# Altium schematic sheet 30_PSFB_Converter.SchDoc
size A2; SheetNumber: 03; SheetTotal: 04; PageSetup: Record=PageOptions|SelectedOnly=False|CenterHorizontal=True|CenterVertical=True|PrintScale=1.00|XCorrection=1.00|YCorrection=1.00|PrintKind=0|BorderSize=5000000|LeftOffset=0|BottomOffset=0|Orientation=2|PaperLength=1000|PaperWidth=1000|Scale=100|PaperSource=7|PrintQuality=-4|MediaType=1|DitherType=10|PaperKind=Letter 8 ½ x 11 Zoll|PrintScaleMode=1; document: xxx; type: ESL; version: 03; standard_checked: PPS-W; mod_ind: 0; mod_quan: 0; change_number: xxxxxx; material_number: Labops_PCB04; replace_for_date: YYYY-MM-DD; replace_for_index: -; doc_type: ESP
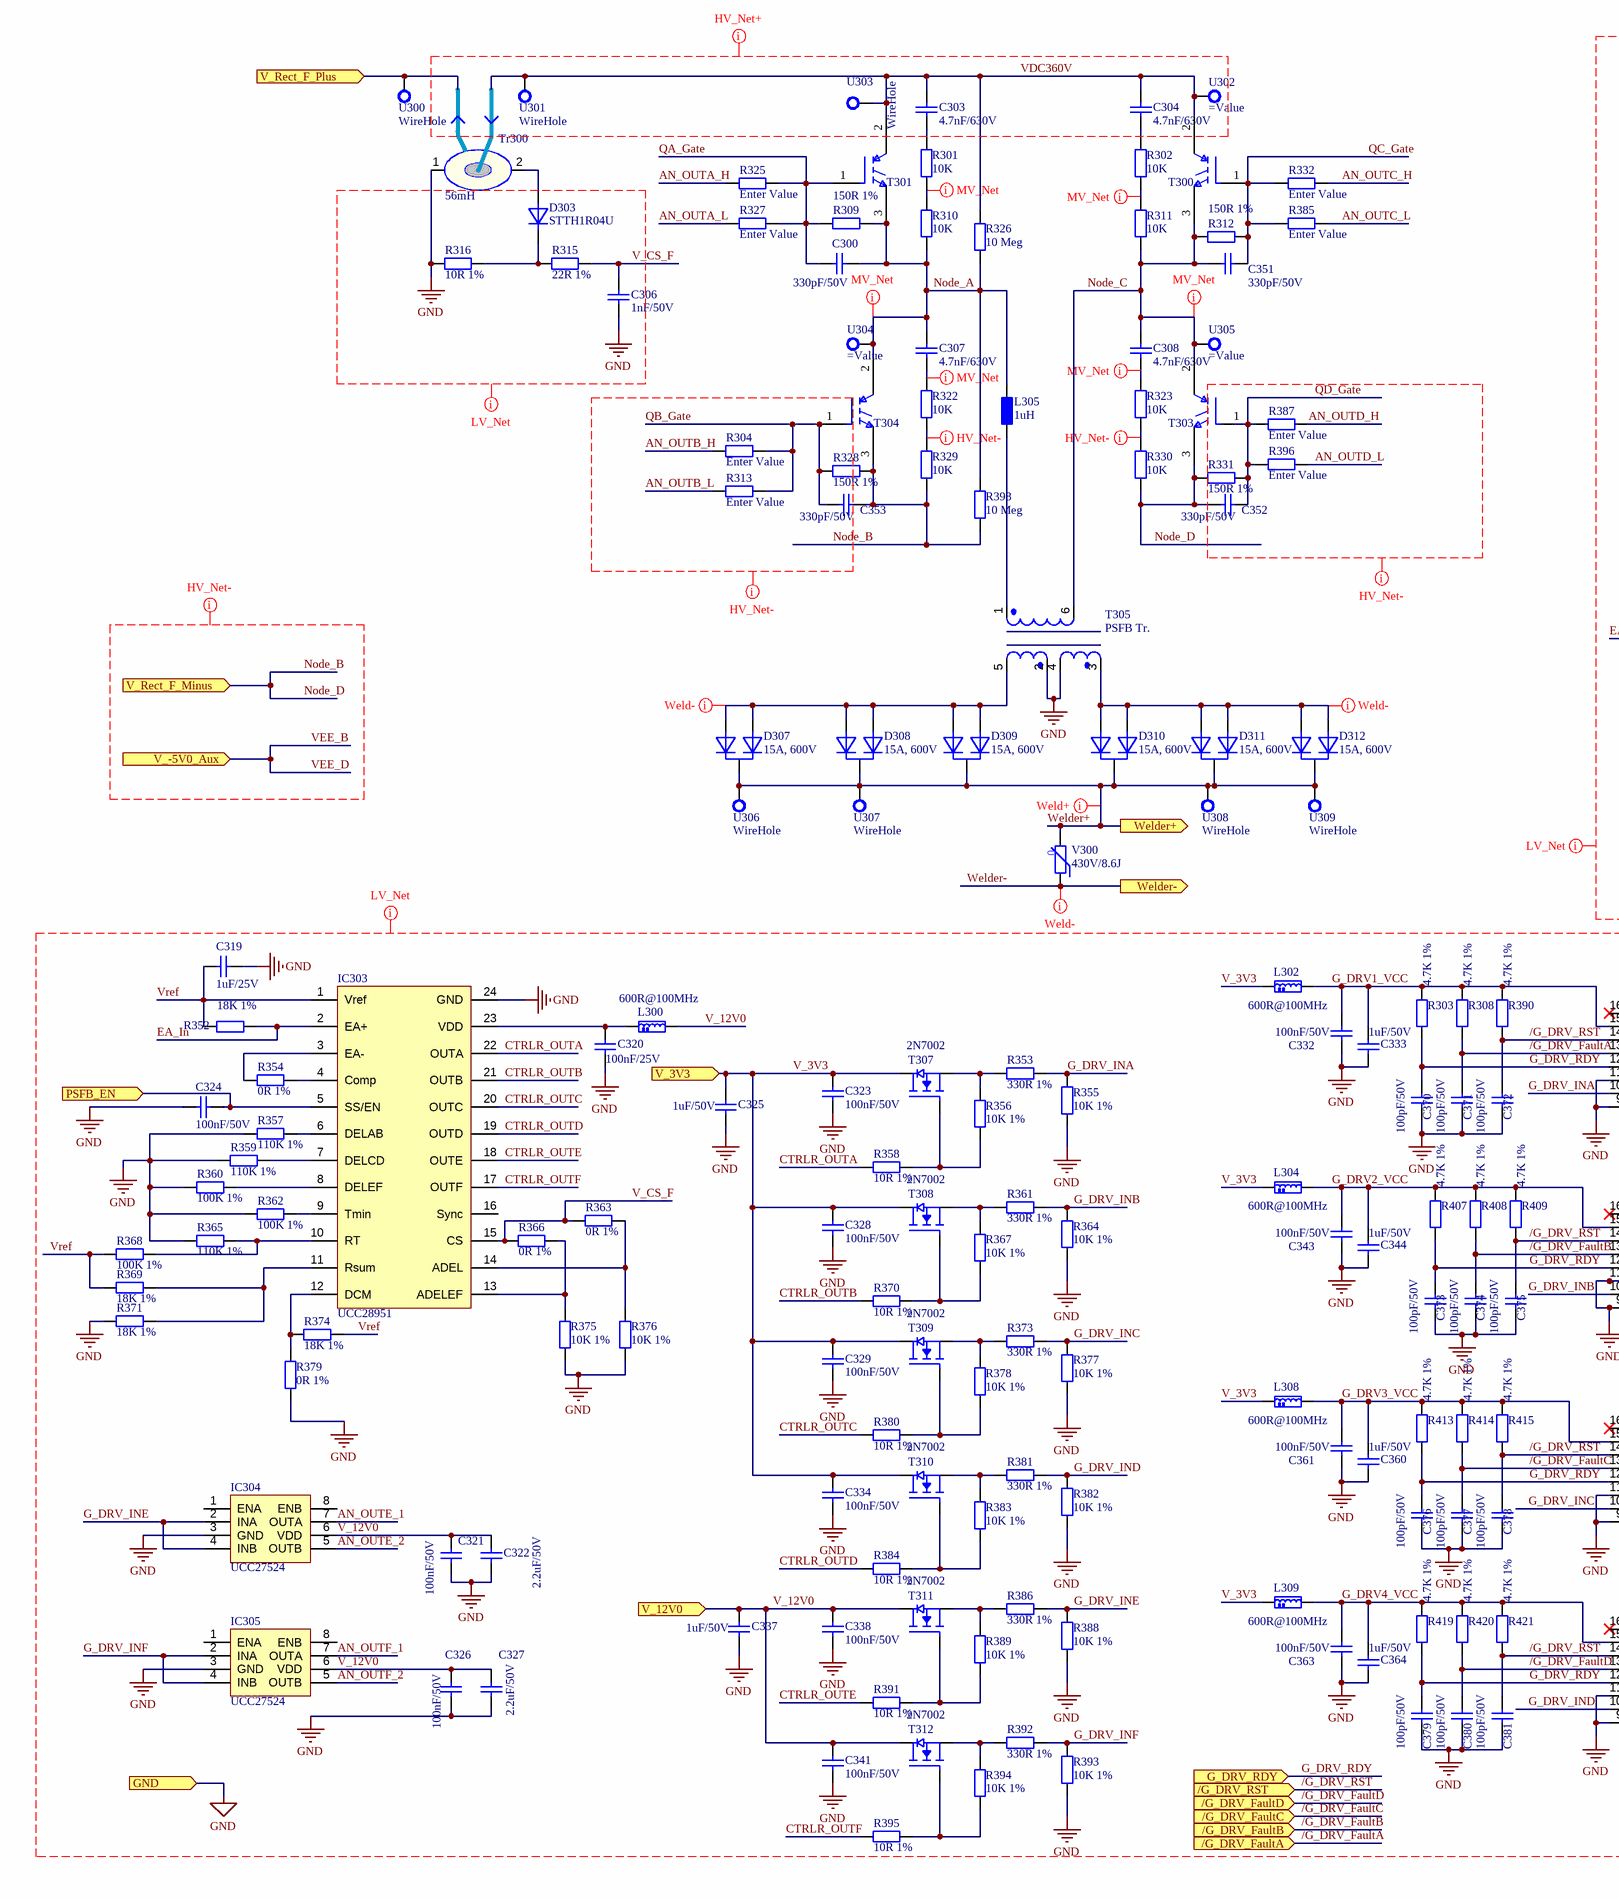
[diagram p0: 30_PSFB_Converter.SchDoc, left]
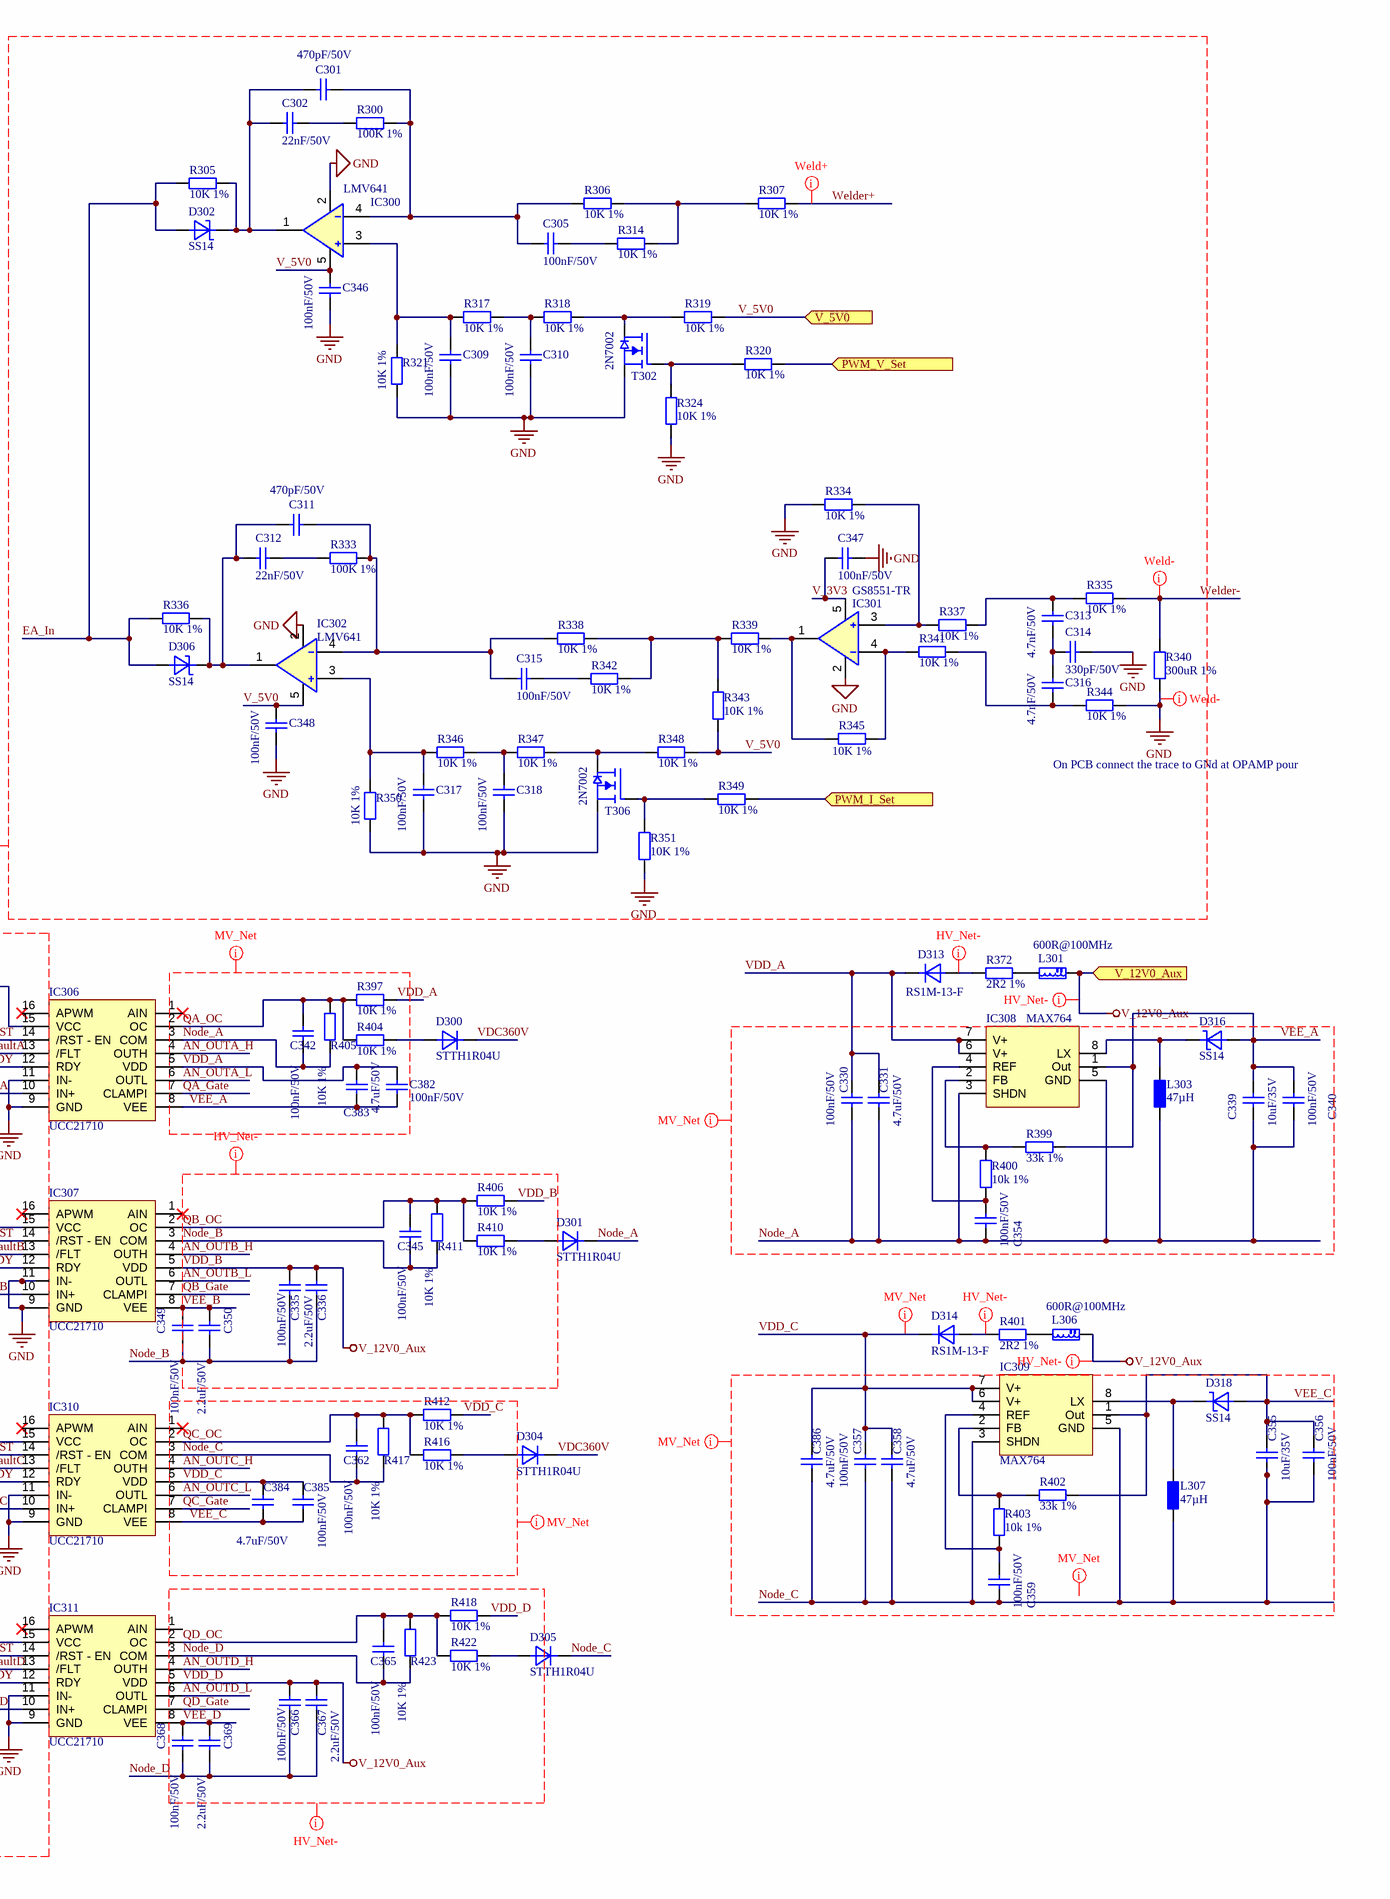
[diagram p1: 30_PSFB_Converter.SchDoc, right]

## Parts
C300  330pF/50V  [EIA0603]
C301  470pF/50V  [EIA0603]
C302  22nF/50V  [EIA0603]
C303  4.7nF/630V  [C_Disc_P5H13]
C304  4.7nF/630V  [C_Disc_P5H13]
C305  100nF/50V  [EIA0603]
C306  1nF/50V  [EIA0603]
C307  4.7nF/630V  [C_Disc_P5H13]
C308  4.7nF/630V  [C_Disc_P5H13]
C309  100nF/50V  [EIA0603]
C310  100nF/50V  [EIA0603]
C311  470pF/50V  [EIA0603]
C312  22nF/50V  [EIA0603]
C313  4.7nF/50V  [EIA0603]
C314  330pF/50V  [EIA0603]
C315  100nF/50V  [EIA0603]
C316  4.7nF/50V  [EIA0603]
C317  100nF/50V  [EIA0603]
C318  100nF/50V  [EIA0603]
C319  1uF/25V  [EIA0603]
C320  100nF/25V  [EIA0603]
C321  100nF/50V  [EIA0603]
C322  2.2uF/50V  [EIA0603]
C323  100nF/50V  [EIA0603]
C324  100nF/50V  [EIA0603]
C325  1uF/50V  [EIA0603]
C326  100nF/50V  [EIA0603]
C327  2.2uF/50V  [EIA0603]
C328  100nF/50V  [EIA0603]
C329  100nF/50V  [EIA0603]
C330  100nF/50V  [EIA0603]
C331  4.7uF/50V  [EIA0603]
C332  100nF/50V  [EIA0603]
C333  1uF/50V  [EIA0603]
C334  100nF/50V  [EIA0603]
C335  100nF/50V  [EIA0603]
C336  2.2uF/50V  [EIA0603]
C337  1uF/50V  [EIA0603]
C338  100nF/50V  [EIA0603]
C339  10uF/35V  [EIA0603]
C340  100nF/50V  [EIA0603]
C341  100nF/50V  [EIA0603]
C342  100nF/50V  [EIA0603]
C343  100nF/50V  [EIA0603]
C344  1uF/50V  [EIA0603]
C345  100nF/50V  [EIA0603]
C346  100nF/50V  [EIA0603]
C347  100nF/50V  [EIA0603]
C348  100nF/50V  [EIA0603]
C349  100nF/50V  [EIA0603]
C350  2.2uF/50V  [EIA0603]
C351  330pF/50V  [EIA0603]
C352  330pF/50V  [EIA0603]
C353  330pF/50V  [EIA0603]
C354  100nF/50V  [EIA0603]
C355  10uF/35V  [EIA0603]
C356  100nF/50V  [EIA0603]
C357  100nF/50V  [EIA0603]
C358  4.7uF/50V  [EIA0603]
C359  100nF/50V  [EIA0603]
C360  1uF/50V  [EIA0603]
C361  100nF/50V  [EIA0603]
C362  100nF/50V  [EIA0603]
C363  100nF/50V  [EIA0603]
C364  1uF/50V  [EIA0603]
C365  100nF/50V  [EIA0603]
C366  100nF/50V  [EIA0603]
C367  2.2uF/50V  [EIA0603]
C368  100nF/50V  [EIA0603]
C369  2.2uF/50V  [EIA0603]
C370  100pF/50V  [EIA0603]
C371  100pF/50V  [EIA0603]
C372  100pF/50V  [EIA0603]
C373  100pF/50V  [EIA0603]
C374  100pF/50V  [EIA0603]
C375  100pF/50V  [EIA0603]
C376  100pF/50V  [EIA0603]
C377  100pF/50V  [EIA0603]
C378  100pF/50V  [EIA0603]
C379  100pF/50V  [EIA0603]
C380  100pF/50V  [EIA0603]
C381  100pF/50V  [EIA0603]
C382  100nF/50V  [EIA0603]
C383  4.7uF/50V  [EIA0603]
C384  4.7uF/50V  [EIA0603]
C385  100nF/50V  [EIA0603]
C386  4.7uF/50V  [EIA0603]
D300  STTH1R04U  [SMB]
D301  STTH1R04U  [SMB]
D302  SS14  [SMA]
D303  STTH1R04U  [SMB]
D304  STTH1R04U  [SMB]
D305  STTH1R04U  [SMB]
D306  SS14  [SMA]
D307  15A, 600V  [TO247-AD]
D308  15A, 600V  [TO247-AD]
D309  15A, 600V  [TO247-AD]
D310  15A, 600V  [TO247-AD]
D311  15A, 600V  [TO247-AD]
D312  15A, 600V  [TO247-AD]
D313  RS1M-13-F  [SMA]
D314  RS1M-13-F  [SMA]
D316  SS14  [SMA]
D318  SS14  [SMA]
IC300  LMV641  [SOT23-5]
IC301  GS8551-TR  [SOT23-5]
IC302  LMV641  [SOT23-5]
IC303  UCC28951  [TSSOP24]
IC304  UCC27524  [VSSOP-8]
IC305  UCC27524  [VSSOP-8]
IC306  UCC21710  [SOIC16_Wide_HV]
IC307  UCC21710  [SOIC16_Wide_HV]
IC308  MAX764  [SOIC8]
IC309  MAX764  [SOIC8]
IC310  UCC21710  [SOIC16_Wide_HV]
IC311  UCC21710  [SOIC16_Wide_HV]
L300  600R@100MHz  [Ferrite_Smd_0603]
L301  600R@100MHz  [Ferrite_Smd_0603]
L302  600R@100MHz  [Ferrite_Smd_0603]
L303  47µH  [SRN8040TA]
L304  600R@100MHz  [Ferrite_Smd_0603]
L305  1uH  [SRP1770TA]
L306  600R@100MHz  [Ferrite_Smd_0603]
L307  47µH  [SRN8040TA]
L308  600R@100MHz  [Ferrite_Smd_0603]
L309  600R@100MHz  [Ferrite_Smd_0603]
R300  100K 1%  [EIA0603]
R301  10K  [2010Resistor]
R302  10K  [2010Resistor]
R303  4.7K 1%  [EIA0603]
R304  Enter Value  [2010Resistor]
R305  10K 1%  [EIA0603]
R306  10K 1%  [EIA0603]
R307  10K 1%  [EIA0603]
R308  4.7K 1%  [EIA0603]
R309  150R 1%  [EIA1206]
R310  10K  [2010Resistor]
R311  10K  [2010Resistor]
R312  150R 1%  [EIA1206]
R313  Enter Value  [2010Resistor]
R314  10K 1%  [EIA0603]
R315  22R 1%  [EIA0603]
R316  10R 1%  [EIA1206]
R317  10K 1%  [EIA0603]
R318  10K 1%  [EIA0603]
R319  10K 1%  [EIA0603]
R320  10K 1%  [EIA0603]
R321  10K 1%  [EIA0603]
R322  10K  [2010Resistor]
R323  10K  [2010Resistor]
R324  10K 1%  [EIA0603]
R325  Enter Value  [2010Resistor]
R326  10 Meg  [RES-RM12.5-VR37]
R327  Enter Value  [2010Resistor]
R328  150R 1%  [EIA1206]
R329  10K  [2010Resistor]
R330  10K  [2010Resistor]
R331  150R 1%  [EIA1206]
R332  Enter Value  [2010Resistor]
R333  100K 1%  [EIA0603]
R334  10K 1%  [EIA0603]
R335  10K 1%  [EIA0603]
R336  10K 1%  [EIA0603]
R337  10K 1%  [EIA0603]
R338  10K 1%  [EIA0603]
R339  10K 1%  [EIA0603]
R340  300uR 1%  [WSLP3921L]
R341  10K 1%  [EIA0603]
R342  10K 1%  [EIA0603]
R343  10K 1%  [EIA0603]
R344  10K 1%  [EIA0603]
R345  10K 1%  [EIA0603]
R346  10K 1%  [EIA0603]
R347  10K 1%  [EIA0603]
R348  10K 1%  [EIA0603]
R349  10K 1%  [EIA0603]
R350  10K 1%  [EIA0603]
R351  10K 1%  [EIA0603]
R352  18K 1%  [EIA0603]
R353  330R 1%  [EIA0603]
R354  0R 1%  [EIA0603]
R355  10K 1%  [EIA0603]
R356  10K 1%  [EIA0603]
R357  110K 1%  [EIA0603]
R358  10R 1%  [EIA0603]
R359  110K 1%  [EIA0603]
R360  100K 1%  [EIA0603]
R361  330R 1%  [EIA0603]
R362  100K 1%  [EIA0603]
R363  0R 1%  [EIA0603]
R364  10K 1%  [EIA0603]
R365  110K 1%  [EIA0603]
R366  0R 1%  [EIA0603]
R367  10K 1%  [EIA0603]
R368  100K 1%  [EIA0603]
R369  18K 1%  [EIA0603]
R370  10R 1%  [EIA0603]
R371  18K 1%  [EIA0603]
R372  2R2 1%  [EIA1206]
R373  330R 1%  [EIA0603]
R374  18K 1%  [EIA0603]
R375  10K 1%  [EIA0603]
R376  10K 1%  [EIA0603]
R377  10K 1%  [EIA0603]
R378  10K 1%  [EIA0603]
R379  0R 1%  [EIA0603]
R380  10R 1%  [EIA0603]
R381  330R 1%  [EIA0603]
R382  10K 1%  [EIA0603]
R383  10K 1%  [EIA0603]
R384  10R 1%  [EIA0603]
R385  Enter Value  [2010Resistor]
R386  330R 1%  [EIA0603]
R387  Enter Value  [2010Resistor]
R388  10K 1%  [EIA0603]
R389  10K 1%  [EIA0603]
R390  4.7K 1%  [EIA0603]
R391  10R 1%  [EIA0603]
R392  330R 1%  [EIA0603]
R393  10K 1%  [EIA0603]
R394  10K 1%  [EIA0603]
R395  10R 1%  [EIA0603]
R396  Enter Value  [2010Resistor]
R397  10K 1%  [EIA0603]
R398  10 Meg  [RES-RM12.5-VR37]
R399  33k 1%  [EIA1206]
R400  10k 1%  [EIA1206]
R401  2R2 1%  [EIA1206]
R402  33k 1%  [EIA1206]
R403  10k 1%  [EIA1206]
R404  10K 1%  [EIA0603]
R405  10K 1%  [EIA0603]
R406  10K 1%  [EIA0603]
R407  4.7K 1%  [EIA0603]
R408  4.7K 1%  [EIA0603]
R409  4.7K 1%  [EIA0603]
R410  10K 1%  [EIA0603]
R411  10K 1%  [EIA0603]
R412  10K 1%  [EIA0603]
R413  4.7K 1%  [EIA0603]
R414  4.7K 1%  [EIA0603]
R415  4.7K 1%  [EIA0603]
R416  10K 1%  [EIA0603]
R417  10K 1%  [EIA0603]
R418  10K 1%  [EIA0603]
R419  4.7K 1%  [EIA0603]
R420  4.7K 1%  [EIA0603]
R421  4.7K 1%  [EIA0603]
R422  10K 1%  [EIA0603]
R423  10K 1%  [EIA0603]
T300  STGW30H60DFB  [TO247-AC]  (value not drawn)
T301  STGW30H60DFB  [TO247-AC]  (value not drawn)
T302  2N7002  [SOT23-3N]
T303  STGW30H60DFB  [TO247-AC]  (value not drawn)
T304  STGW30H60DFB  [TO247-AC]  (value not drawn)
T305  PSFB Tr.  [11-0060-A]
T306  2N7002  [SOT23-3N]
T307  2N7002  [SOT23-3N]
T308  2N7002  [SOT23-3N]
T309  2N7002  [SOT23-3N]
T310  2N7002  [SOT23-3N]
T311  2N7002  [SOT23-3N]
T312  2N7002  [SOT23-3N]
Tr300  56mH  [CST206-2A]
U300  WireHole  [PAD-3.0x6.0MM]  (no BOM)
U301  WireHole  [PAD-3.0x6.0MM]  (no BOM)
U302  (no value)  [PAD-3.0x6.0MM]  (no BOM)
U303  WireHole  [PAD-3.0x6.0MM]  (no BOM)
U304  (no value)  [PAD-3.0x6.0MM]  (no BOM)
U305  (no value)  [PAD-3.0x6.0MM]  (no BOM)
U306  WireHole  [PAD-3.0x6.0MM]  (no BOM)
U307  WireHole  [PAD-3.0x6.0MM]  (no BOM)
U308  WireHole  [PAD-3.0x6.0MM]  (no BOM)
U309  WireHole  [PAD-3.0x6.0MM]  (no BOM)
V300  430V/8.6J  [EPCOS_B72205S0271K101]

## Ports
/G_DRV_FaultA (in), /G_DRV_FaultB (in), /G_DRV_FaultC (in), /G_DRV_FaultD (in), /G_DRV_RST (in), G_DRV_RDY (in), GND (in), PSFB_EN (in), PWM_I_Set (in), PWM_V_Set (in), V_3V3 (in), V_5V0 (in), V_12V0 (in), V_12V0_Aux (in), V_-5V0_Aux (in), V_Rect_F_Minus (in), V_Rect_F_Plus (in), Welder+ (out), Welder- (out)

## Nets
GND: C306.1 C309.1 C310.1 C314.1 C317.1 C318.1 C319.2 C320.1 C321.1 C322.1 C323.1 C324.2 C325.1 C326.1 C327.1 C328.1 C329.1 C332.1 C333.1 C334.1 C337.1 C338.1 C341.1 C343.1 C344.1 C346.1 C347.1 C348.1 C360.1 C361.1 C363.1 C364.1 C370.1 C371.1 C372.1 C373.1 C374.1 C375.1 C376.1 C377.1 C378.1 C379.1 C380.1 C381.1 IC300.2 IC301.2 IC302.2 IC303.24(GND) IC304.3(GND) IC305.3(GND) IC306.9(GND) IC306.11(IN-) IC307.9(GND) IC307.11(IN-) IC310.9(GND) IC310.11(IN-) IC311.9(GND) IC311.11(IN-) R316.1 R321.2 R324.1 R334.1 R340.1 R344.2 R350.2 R351.1 R355.2 R357.1 R359.1 R360.1 R362.1 R364.2 R365.2 R371.1 R375.1 R376.1 R377.2 R379.2 R382.2 R388.2 R393.2 T302.2 T305.2 T305.4 T306.2 Tr300.1 ; port GND
VDD_B: C335.2 C336.2 C366.2 C367.2 IC307.5(VDD) IC311.5(VDD) L301.1 L306.1 R406.2 R418.2 ; port V_12V0_Aux  [also labelled V_12V0_Aux, VDD_D]
/G_DRV_FaultA: C371.2 IC306.13(/FLT) R308.2 ; port /G_DRV_FaultA
/G_DRV_FaultB: C374.2 IC307.13(/FLT) R408.2 ; port /G_DRV_FaultB
/G_DRV_FaultC: C377.2 IC310.13(/FLT) R414.2 ; port /G_DRV_FaultC
/G_DRV_FaultD: C380.2 IC311.13(/FLT) R420.2 ; port /G_DRV_FaultD
/G_DRV_RST: C372.2 C375.2 C378.2 C381.2 IC306.14(/RST_-_EN) IC307.14(/RST_-_EN) IC310.14(/RST_-_EN) IC311.14(/RST_-_EN) R390.2 R409.2 R415.2 R421.2 ; port /G_DRV_RST
AN_OUTA_H: IC306.4(OUTH) R325.1
AN_OUTA_L: IC306.6(OUTL) R327.1
AN_OUTB_H: IC307.4(OUTH) R304.1
AN_OUTB_L: IC307.6(OUTL) R313.1
AN_OUTC_H: IC310.4(OUTH) R332.1
AN_OUTC_L: IC310.6(OUTL) R385.1
AN_OUTD_H: IC311.4(OUTH) R387.1
AN_OUTD_L: IC311.6(OUTL) R396.1
AN_OUTE_1: IC304.7(OUTA)
AN_OUTE_2: IC304.5(OUTB)
AN_OUTF_1: IC305.7(OUTA)
AN_OUTF_2: IC305.5(OUTB)
CTRLR_OUTA: IC303.22(OUTA) R358.1
CTRLR_OUTB: IC303.21(OUTB) R370.1
CTRLR_OUTC: IC303.20(OUTC) R380.1
CTRLR_OUTD: IC303.19(OUTD) R384.1
CTRLR_OUTE: IC303.18(OUTE) R391.1
CTRLR_OUTF: IC303.17(OUTF) R395.1
EA_In: D302.1 D306.1 IC303.2(EA+) R305.2 R336.2 R352.2
G_DRV1_VCC: C332.2 C333.2 IC306.15(VCC) L302.2 R303.1 R308.1 R390.1
G_DRV2_VCC: C343.2 C344.2 IC307.15(VCC) L304.2 R407.1 R408.1 R409.1
G_DRV3_VCC: C360.2 C361.2 IC310.15(VCC) L308.2 R413.1 R414.1 R415.1
G_DRV4_VCC: C363.2 C364.2 IC311.15(VCC) L309.2 R419.1 R420.1 R421.1
G_DRV_INA: IC306.10(IN+) R353.1 R355.1
G_DRV_INB: IC307.10(IN+) R361.1 R364.1
G_DRV_INC: IC310.10(IN+) R373.1 R377.1
G_DRV_IND: IC311.10(IN+) R381.1 R382.1
G_DRV_INE: IC304.2(INA) IC304.4(INB) R386.1 R388.1
G_DRV_INF: IC305.2(INA) IC305.4(INB) R392.1 R393.1
G_DRV_RDY: C370.2 C373.2 C376.2 C379.2 IC306.12(RDY) IC307.12(RDY) IC310.12(RDY) IC311.12(RDY) R303.2 R407.2 R413.2 R419.2 ; port G_DRV_RDY
Node_A: C300.1 C307.2 C330.1 C331.1 C339.1 C340.1 C342.1 C354.1 D301.K IC306.3(COM) IC308.3(SHDN) IC308.5(GND) L303.1 L305.2 R309.1 R310.1 R326.1 R398.2 R405.2 T301.3(E) T304.2(C) U304.1
Node_B: C335.1 C336.1 C345.1 C349.1 C350.1 C352.2 C353.1 C365.1 C366.1 C367.1 C368.1 C369.1 IC307.3(COM) IC311.3(COM) R328.1 R329.1 R330.1 R331.1 R398.1 R411.2 R423.2 T303.3(E) T304.3(E) ; port V_Rect_F_Minus  [also labelled Node_D]
Node_C: C308.2 C351.2 C355.1 C356.1 C357.1 C358.1 C359.1 C362.1 C386.1 D305.K IC309.3(SHDN) IC309.5(GND) IC310.3(COM) L307.1 R311.1 R312.1 R417.2 T300.3(E) T303.2(C) T305.6 U305.1
PSFB_EN: C324.1 IC303.5(SS/EN) ; port PSFB_EN
PWM_I_Set: R349.2 ; port PWM_I_Set
PWM_V_Set: R320.2 ; port PWM_V_Set
QA_Gate: C300.2 IC306.7(CLAMPI) R309.2 R325.2 R327.2 T301.1(GATE)
QA_OC: C342.2 IC306.2(OC) R397.1 R404.1 R405.1
QB_Gate: C353.2 IC307.7(CLAMPI) R304.2 R313.2 R328.2 T304.1(GATE)
QB_OC: C345.2 IC307.2(OC) R406.1 R410.1 R411.1
QC_Gate: C351.1 IC310.7(CLAMPI) R312.2 R332.2 R385.2 T300.1(GATE)
QC_OC: C362.2 IC310.2(OC) R412.1 R416.1 R417.1
QD_Gate: C352.1 IC311.7(CLAMPI) R331.2 R387.2 R396.2 T303.1(GATE)
QD_OC: C365.2 IC311.2(OC) R418.1 R422.1 R423.1
V_3V3: C323.2 C325.2 C328.2 C329.2 C334.2 C347.2 IC301.5 L302.1 L304.1 L308.1 L309.1 T307.3 T308.3 T309.3 T310.3 ; port V_3V3
V_5V0: C346.2 C348.2 IC300.5 IC302.5 R319.2 R343.1 R348.2 ; port V_5V0
V_12V0: C321.2 C322.2 C326.2 C327.2 C337.2 C338.2 C341.2 IC304.6(VDD) IC305.6(VDD) L300.2 T311.3 T312.3 ; port V_12V0
V_CS_F: C306.2 IC303.15(CS) R315.1 R363.1 R366.1
V_Rect_F_Plus: U300.1 ; port V_Rect_F_Plus
VDC360V: C303.2 C304.2 D300.K D304.K R326.2 T300.2(C) T301.2(C) U301.1 U302.1 U303.1
VDD_A: C330.2 C331.2 C382.1 C383.2 D313.K IC306.5(VDD) IC308.6(V+) IC308.7(V+) R397.2
VDD_C: C357.2 C358.2 C384.2 C385.1 C386.2 D314.K IC309.6(V+) IC309.7(V+) IC310.5(VDD) R412.2
VEE_A: C339.2 C340.2 C382.2 C383.1 D316.1 IC306.8(VEE) IC308.1(Out) R399.1
VEE_B: C349.2 C350.2 C368.2 C369.2 IC307.8(VEE) IC311.8(VEE) ; port V_-5V0_Aux  [also labelled VEE_D]
VEE_C: C355.2 C356.2 C384.1 C385.2 D318.1 IC309.1(Out) IC310.8(VEE) R402.1
Vref: C319.1 IC303.1(Vref) R352.1 R368.2 R369.1 R374.2
Welder+: D307.2 D308.2 D309.2 D310.2 D311.2 D312.2 R307.2 U306.1 U307.1 U308.1 U309.1 V300.2 ; port Welder+
Welder-: R335.2 R340.2 V300.1 ; port Welder-
NetC301_1: C301.1 C305.2 IC300.4 R300.1 R306.2
NetC301_2: C301.2 C302.2 D302.2 IC300.1 R305.1
NetC302_1: C302.1 R300.2
NetC303_1: C303.1 R301.2
NetC304_1: C304.1 R302.2
NetC305_1: C305.1 R314.2
NetC307_1: C307.1 R322.2
NetC308_1: C308.1 R323.2
NetC309_2: C309.2 IC300.3 R317.2 R321.1
NetC310_2: C310.2 R317.1 R318.2
NetC311_1: C311.1 C315.2 IC302.4 R333.1 R338.2
NetC311_2: C311.2 C312.2 D306.2 IC302.1 R336.1
NetC312_1: C312.1 R333.2
NetC313_1: C313.1 C314.2 C316.2
NetC313_2: C313.2 R335.1 R337.2
NetC315_1: C315.1 R342.2
NetC316_1: C316.1 R341.2 R344.1
NetC317_2: C317.2 IC302.3 R346.2 R350.1
NetC318_2: C318.2 R346.1 R347.2
NetC320_2: C320.2 IC303.23(VDD) L300.1
NetC354_2: C354.2 IC308.4(REF) R400.1
NetC359_2: C359.2 IC309.4(REF) R403.1
NetD300_A: D300.A R404.2
NetD301_A: D301.A R410.2
NetD303_A: D303.A Tr300.2
NetD303_K: D303.K R315.2 R316.2
NetD304_A: D304.A R416.2
NetD305_A: D305.A R422.2
NetD307_1: D307.1 D307.3 D308.1 D308.3 D309.1 D309.3 T305.5
NetD310_1: D310.1 D310.3 D311.1 D311.3 D312.1 D312.3 T305.3
NetD313_A: D313.A R372.1
NetD314_A: D314.A R401.1
NetD316_2: D316.2 IC308.8(LX) L303.2
NetD318_2: D318.2 IC309.8(LX) L307.2
NetIC301_1: IC301.1 R339.2 R345.2
NetIC301_3: IC301.3 R334.2 R337.1
NetIC301_4: IC301.4 R341.1 R345.1
NetIC303_3: IC303.3(EA-) R354.1
NetIC303_4: IC303.4(Comp) R354.2
NetIC303_6: IC303.6(DELAB) R357.2
NetIC303_7: IC303.7(DELCD) R359.2
NetIC303_8: IC303.8(DELEF) R360.2
NetIC303_9: IC303.9(Tmin) R362.2
NetIC303_10: IC303.10(RT) R365.1 R368.1
NetIC303_11: IC303.11(Rsum) R369.2 R371.2
NetIC303_12: IC303.12(DCM) R374.1 R379.1
NetIC303_13: IC303.13(ADELEF) R366.2 R375.2
NetIC303_14: IC303.14(ADEL) R363.2 R376.2
NetIC308_2: IC308.2(FB) R399.2 R400.2
NetIC309_2: IC309.2(FB) R402.2 R403.2
NetL301_2: L301.2 R372.2
NetL305_1: L305.1 T305.1
NetL306_2: L306.2 R401.2
NetR301_1: R301.1 R310.2
NetR302_1: R302.1 R311.2
NetR306_1: R306.1 R307.1 R314.1
NetR318_1: R318.1 R319.1 T302.3
NetR320_1: R320.1 R324.2 T302.1
NetR322_1: R322.1 R329.2
NetR323_1: R323.1 R330.2
NetR338_1: R338.1 R339.1 R342.1 R343.2
NetR347_1: R347.1 R348.1 T306.3
NetR349_1: R349.1 R351.2 T306.1
NetR353_2: R353.2 R356.2 T307.2
NetR356_1: R356.1 R358.2 T307.1
NetR361_2: R361.2 R367.2 T308.2
NetR367_1: R367.1 R370.2 T308.1
NetR373_2: R373.2 R378.2 T309.2
NetR378_1: R378.1 R380.2 T309.1
NetR381_2: R381.2 R383.2 T310.2
NetR383_1: R383.1 R384.2 T310.1
NetR386_2: R386.2 R389.2 T311.2
NetR389_1: R389.1 R391.2 T311.1
NetR392_2: R392.2 R394.2 T312.2
NetR394_1: R394.1 R395.2 T312.1

Not connected (* = marked no-connect by the designer): IC303 16(Sync); IC304 1(ENA) 8(ENB); IC305 1(ENA) 8(ENB); IC306 1(AIN)* 16(APWM)*; IC307 1(AIN)* 16(APWM)*; IC310 1(AIN)* 16(APWM)*; IC311 1(AIN) 16(APWM)*

## Layout directives
net class HV_Net+: VDC360V
net class HV_Net-: AN_OUTB_H, AN_OUTB_L, AN_OUTD_H, AN_OUTD_L, NetD313_A, NetD314_A, NetR322_1, NetR323_1, Node_B, Node_D, QB_Gate, QB_OC, QD_Gate, QD_OC, V_12V0_Aux, VDD_B, VDD_D, VEE_B, VEE_D
net class LV_Net: /G_DRV_FaultA, /G_DRV_FaultB, /G_DRV_FaultC, /G_DRV_FaultD, /G_DRV_RST, AN_OUTE_1, AN_OUTE_2, AN_OUTF_1, AN_OUTF_2, CTRLR_OUTA, CTRLR_OUTB, CTRLR_OUTC, CTRLR_OUTD, CTRLR_OUTE, CTRLR_OUTF, EA_In, G_DRV1_VCC, G_DRV2_VCC, G_DRV3_VCC, G_DRV4_VCC, G_DRV_INA, G_DRV_INB, G_DRV_INC, G_DRV_IND, G_DRV_INE, G_DRV_INF, G_DRV_RDY, GND, V_3V3, V_5V0, V_12V0, V_CS_F, Vref, Welder+, Welder-
net class MV_Net: AN_OUTA_H, AN_OUTA_L, AN_OUTC_H, AN_OUTC_L, NetC307_1, NetC308_1, NetR301_1, NetR302_1, Node_A, Node_C, QA_Gate, QA_OC, QC_Gate, QC_OC, VDD_A, VDD_C, VEE_A, VEE_C
net class Weld+: Welder+
net class Weld-: GND, NetD307_1, NetD310_1, Welder-

## Notes on the sheet
- On PCB connect the trace to GNd at OPAMP pour
- Assembly variant:
- DIN ISO 2768-mK
- DIN ISO 8015
- standards
- general
- replace for
- replace for index
- DIN EN ISO 1302
- surface
- material number
- description
- document
- EBB
- number
- type
- ESP
- version
- date
- drawn by
- checked
- File:
- mod.
- ind.
- quan.
- change number
- sheet
- of
- (in symbol B72205S0271K101) U

## Library data of the parts
C300-C302 C305 C306 C309-C386 = C_Open_0603: Generic 0603 ceramic capacitor; Manufacturer: Open; ID: 3; Verified Lib: False; Manufacturer P/N: C_Open_0603; Category: Ceramic; Package/Case: 0603; Supplier-1: LCSC; Price: 0.02; created by: Hamad; created On: 12/15/2014
  C300 C314 C351-C353: Part_Value: 330pF/50V
  C301 C311: Part_Value: 470pF/50V
  C302 C312: Part_Value: 22nF/50V
  C305 C309 C310 C315 C317 C318 C321 C323 C324 C326 C328-C330 C332 C334 C335 C338 C340-C343 C345-C349 C354 C356 C357 C359 C361-C363 C365 C366 C368 C382 C385: Part_Value: 100nF/50V
  C306: Part_Value: 1nF/50V
  C313 C316: Part_Value: 4.7nF/50V
  C319: Part_Value: 1uF/25V
  C320: Part_Value: 100nF/25V
  C322 C327 C336 C350 C367 C369: Part_Value: 2.2uF/50V
  C325 C333 C337 C344 C360 C364: Part_Value: 1uF/50V
  C331 C358 C383 C384 C386: Part_Value: 4.7uF/50V
  C339 C355: Part_Value: 10uF/35V
  C370-C381: Part_Value: 100pF/50V
C303 C304 C307 C308 = FG26X7R2J472KNT06: 4700 pF ±10% 630V Ceramic Capacitor X7R Radial; Manufacturer: TDK; ID: 42; Verified Lib: False; Our Stock: 0; Manufacturer P/N: FG26X7R2J472KNT06; Category: Cermaic; Part_Value: 4.7nF/630V; Package/Case: THT 5mm Pitch; Supplier-1: Digkey; Price: 0.23; created by: Hamad; created On: 8/11/2021
D300 D301 D303-D305 = STTH1R04U: 1A, 400V, SMB, Fast Recovery; Manufacturer: Stmicro; ID: 14; Our Stock: 30; Verified Lib: False; Manufacturer P/N: STTH1R04U; Category: Gen Purpose; Part_Value: STTH1R04U; Package/Case: SMB; Supplier-1: LCSC; Supplier-2: Digikey; Price: 0.09; created by: HamadA; created on: 7/28/2021
D302 D306 D316 D318 = SS14-LTP: Schottky 1A/40V SMA; Manufacturer: MCC; ID: 16; Our Stock: 30; Verified Lib: False; Manufacturer P/N: SS14-LTP; Category: Schottky; Part_Value: SS14; Package/Case: SMA; Supplier-1: LCSC; Supplier-2: Digikey; Price: 0.03; created by: HamadA; created on: 8/11/2021
D307-D312 = FEP30JP-E3/45: Dual Diode, Fast Recovery, 15A,600V, Common Cathode, TO-247AD; Manufacturer: Vishay; ID: 20; Our Stock: 30; Verified Lib: False; Manufacturer P/N: FEP30JP-E3/45; Category: Fast Recovery; Part_Value: 15A, 600V; Package/Case: TO247-AD; Supplier-1: LCSC; Supplier-2: Digikey; Price: 2.14; created by: HamadA; created on: 8/15/2021
D313 D314 = RS1M-13-F: 1KV,1A,500ns, SMA; Manufacturer: Diodes; ID: 17; Our Stock: 30; Verified Lib: False; Manufacturer P/N: RS1M-13-F; Category: Gen Purpose; Part_Value: RS1M-13-F; Package/Case: SMA; Supplier-1: LCSC; Supplier-2: Digikey; Price: 0.09; created by: HamadA; created on: 8/13/2021
IC300 IC302 = LMV641MF/NOPB: 1CH 10MHz 1 Low power 2.3 V/us 2.7V~12V SOT-23-5 OpAmp; Manufacturer: Texas Instruments; Parts availabe: 10; ID: 35; Verified Lib: False; Manufacturer P/N: LMV641MF/NOPB; Category: Opamp; Part_Value: LMV641; Package/Case: SOT23-5; Supplier-1: LCSC; Price: 2.0; created On: 10/10/2021; Our Stock: 10
IC301 = GS8551-TR: 1.8MHz 1 Zero-Drift 180uA 0.95 V/us 1.8V ~ 5.5V SOT-23-5 Precision OpAmps; Manufacturer: Gainsil; Parts availabe: 10; ID: 31; Verified Lib: False; Manufacturer P/N: GS8551-TR; Category: Opamp; Part_Value: GS8551-TR; Package/Case: SOT23-5; Supplier-1: LCSC; Price: 0.35; created On: 8/11/2021; Our Stock: 10
IC303 = UCC28951QPWRQ1: Phase Shift Full Bridge Controller, TSSOP24; Manufacturer: Texas Instruments; Parts availabe: 8; ID: 29; Verified Lib: False; PackageVersion: 2010; ComponentLink1Description: Manufacturer URL; ComponentLink1URL: http://www.st.com/; ComponentLink2Description: STM8L151/152,x4,x6 Datasheet; ComponentLink2URL: http://www.st.com/internet/com/TECHNICAL_RESOURCES/TECHNICAL_LITERATURE/DATASHEET/CD00240181.pdf; ComponentLink3Description: STM8L Family Web Page; ComponentLink3URL: http://www.st.com/internet/mcu/subclass/1381.jsp; Manufacturer P/N: UCC28951QPWRQ1; Category: Converter Controller; Part_Value: UCC28951; Package/Case: TSSOP24; Supplier-1: Digikey; Price: 6.02; created On: 8/9/2021; Our Stock: 8
IC304 IC305 = UCC27524DGN: Low-Side Gate Driver IC Non-Inverting 8-HVSSOP; Manufacturer: Texas Instruments; Parts availabe: 80; ID: 32; Our Stock: 100; Verified Lib: False; Manufacturer P/N: UCC27524DGN; Category: Gate Driver; Part_Value: UCC27524; Package/Case: VSSOP-8; Supplier-1: Digikey; Price: 1.5; created On: 8/11/2021
IC306 IC307 IC310 IC311 = UCC21710QDWQ1: Isolated Gate Driver, 10A, 1CH, SOIC-16; Manufacturer: Texas Instruments; Parts availabe: 25; ID: 37; Verified Lib: False; Manufacturer P/N: UCC21710QDWQ1; Category: Gate Driver; Part_Value: UCC21710; Package/Case: SOIC16; Supplier-1: Mouser; Price: 5.05; created On: 10/19/2021; Our Stock: 25
IC308 IC309 = MAX764CSA+: Switching Regulator, Inverting, -5V/Adj SOIC8, Vin 3-16.5V; Manufacturer: Maxim Integrated; Parts availabe: 30; ID: 36; Verified Lib: False; Manufacturer P/N: MAX764CSA+; Category: Voltage Regulator; Part_Value: MAX764; Package/Case: SOIC-8; Supplier-1: Mouser; Price: 4.0; created On: 10/17/2021; Our Stock: 30
L300-L302 L304 L306 L308 L309 = BLM18RK601SN1D: 100 OHM 3A 0603; Manufacturer: Murata; ID: 17; Verified Lib: False; Manufacturer P/N: BLM18RK601SN1D; Category: Ferrite; Part_Value: 600R@100MHz; Package/Case: 0603; Supplier-2: Digikey; supplier Part Number 2: 445-1564-2-ND; created by: HamadA
L303 L307 = SRN8040TA-470M: 47 µH  20% 1MHz 12Q-Factor Ferrite 2A; Manufacturer: Bourns; ID: 20; Verified Lib: False; Manufacturer P/N: SRN8040TA-470M; Category: SMD Inductor; Part_Value: 47µH; Package/Case: SMD; Supplier-1: Mouser; Price: 0.5; created by: HamadA; created On: 10/19/2021; Our Stock: 20
L305 = SRP1770TA-1R0M: 1 µH Shielded Wirewound Inductor 52 A 2mOhm Max Nonstandard; Manufacturer: Bourns; ID: 18; Our Stock: 5; Verified Lib: False; Manufacturer P/N: SRP1770TA-1R0M; Category: SMD Inductor; Part_Value: 1uH; Package/Case: SMD; Supplier-1: Mouser; created by: HamadA; created On: 10/11/2021
R300 R303 R305-R308 R314 R315 R317-R321 R324 R333-R339 R341-R371 R373-R384 R386 R388-R395 R397 R404-R423 = R_Open_0603: Chip Resistor 0603; Manufacturer: open source; ID: 16; Verified Lib: False; Manufacturer P/N: R_Open_0603; Category: Chip Resistor; Package/Case: 0603; Supplier-1: LCSC; Price: 0.005; created by: HamadA
  R300 R333 R360 R362 R368: Part_Value: 100K 1%
  R303 R308 R390 R407-R409 R413-R415 R419-R421: Part_Value: 4.7K 1%
  R305-R307 R314 R317-R321 R324 R334-R339 R341-R351 R355 R356 R364 R367 R375-R378 R382 R383 R388 R389 R393 R394 R397 R404-R406 R410-R412 R416-R418 R422 R423: Part_Value: 10K 1%
  R315: Part_Value: 22R 1%
  R352 R369 R371 R374: Part_Value: 18K 1%
  R353 R361 R373 R381 R386 R392: Part_Value: 330R 1%
  R354 R363 R366 R379: Part_Value: 0R 1%
  R357 R359 R365: Part_Value: 110K 1%
  R358 R370 R380 R384 R391 R395: Part_Value: 10R 1%
R301 R302 R304 R310 R311 R313 R322 R323 R325 R327 R329 R330 R332 R385 R387 R396 = R_Open_2010: Chip Resistor 2010; Manufacturer: open source; ID: 21; Verified Lib: False; Manufacturer P/N: R_Open_2010; Category: Chip Resistor; Package/Case: 2010; Supplier-1: LCSC; Price: 0.01; created by: HamadA; Created On: 10/10/2021
  R301 R302 R310 R311 R322 R323 R329 R330: Part_Value: 10K
  R304 R313 R325 R327 R332 R385 R387 R396: Part_Value: Enter Value
R309 R312 R316 R328 R331 R372 R399-R403 = R_Open_1206: Chip Resistor 1206; Manufacturer: open source; ID: 15; Verified Lib: False; Manufacturer P/N: R_Open_1206; Category: Chip Resistor; Package/Case: 1206; Supplier-1: LCSC; Price: 0.01; created by: HamadA
  R309 R312 R328 R331: Part_Value: 150R 1%
  R316: Part_Value: 10R 1%
  R372 R401: Part_Value: 2R2 1%
  R399 R402: Part_Value: 33k 1%
  R400 R403: Part_Value: 10k 1%
R326 R398 = RNF12FTD10M0: Metal  Film, 1/2W, 10 Meg , 350V, 5% +/-Tol; Manufacturer: Stack Pole Electronics; ID: 21; Our Stock: 50; Verified Lib: False; Manufacturer P/N: RNF12FTD10M0; Category: THT 1/2 Watt; Part_Value: 10 Meg; Package/Case: THT RM12.5 mm; Supplier-1: Digikey; Price: 0.04; created by: HamadA; Created On: 10/11/2021
R340 = WSL5931L3000FEA: Chip Resistor 1206; Manufacturer: Vishay; ID: 20; Our Stock: 5; Verified Lib: False; Manufacturer P/N: WSL5931L3000FEA; Category: Shunt; Part_Value: 300uR 1%; Package/Case: WSL5931L; Supplier-1: Digikey; Price: 0.5; created by: HamadA; Created On: 8/14/2021
T300 T301 T303 T304 = STGW30H60DFB: IGBT Trench Field Stop 600 V 60 A 260 W THT  TO-247AC; Manufacturer: ST; Alternative Part: No; ID: 20; Verified Lib: False; Manufacturer P/N: STGW30H60DFB; Category: IGBT; Part_Value: STGW30H60DFB; Package/Case: TO-247AC; Supplier-1: LCSC; Price: 2.2; created by: HamadA; Create on: 8/11/2021; Our Stock: 20
T302 T306-T312 = 2N7002: N Channel 60V 0.5A, Vthd=2.5V , 350mW; Manufacturer: Diodes,NXP; Alternative Part: No; ID: 17; Verified Lib: False; Manufacturer P/N: 2N7002; Category: NMOSFET; Part_Value: 2N7002; Package/Case: SOT23-3; Supplier-1: LCSC; Price: 0.023; created by: HamadA; Create on: 8/11/2021
T305 = 11-0060-A: 60KHz, PSFB Transformer, 200VAC, 2 Outputs, 4KW,Chinese; Manufacturer: Dongguan Speed Co.; ID: 18; Verified Lib: False; Manufacturer P/N: 11-0060-A; Category: PSFB Transformer; Part_Value: PSFB Tr.; Package/Case: THT; Supplier-1: Dongguan Speed Electronics; created by: HamadA; created On: 8/29/2021
Tr300 = CST206-2A: 80 A - Current Sense Transformer 20kHz ~ 200kHz 3.5Ohm Max 56 mH THT; Manufacturer: Triad Magnetics; ID: 15; Our Stock: 20; Verified Lib: False; Manufacturer P/N: CST206-2A; Category: Current Transformer; Part_Value: 56mH; Package/Case: CST206-2A; Supplier-1: Digikey; created by: Hamad; created On: 8/11/2021
U300-U309 = PAD-3.0X6.0mm: Wire Hole 3.0mm Dia, 6.0mm Pad.; Manufacturer: NA; ID: 4; Verified Lib: False; Manufacturer P/N: PAD-3.0X6.0mm; Category: PCB; Part_Value: WireHole; Package/Case: THT; Supplier-1: NA; Supplier Part Number 1: NA; created by: HamadA; Created On: 8/24/2021
V300 = B72205S0271K101: 430 V 400 A Varistor 1 Circuit Through Hole Disc 5mm; Manufacturer: EPCOS; ID: 1; Our Stock: 30; Verified Lib: False; Manufacturer P/N: B72205S0271K101; Category: Varistor; Part_Value: 430V/8.6J; Package/Case: THT; Supplier-1: LCSC; Price: 0.04; created by: Hamad; created On: 8/12/2021